# EAGLE design Prototype (EAGLE 7.7.0)
AUTHOR: Nathan Campos; REVISION: A
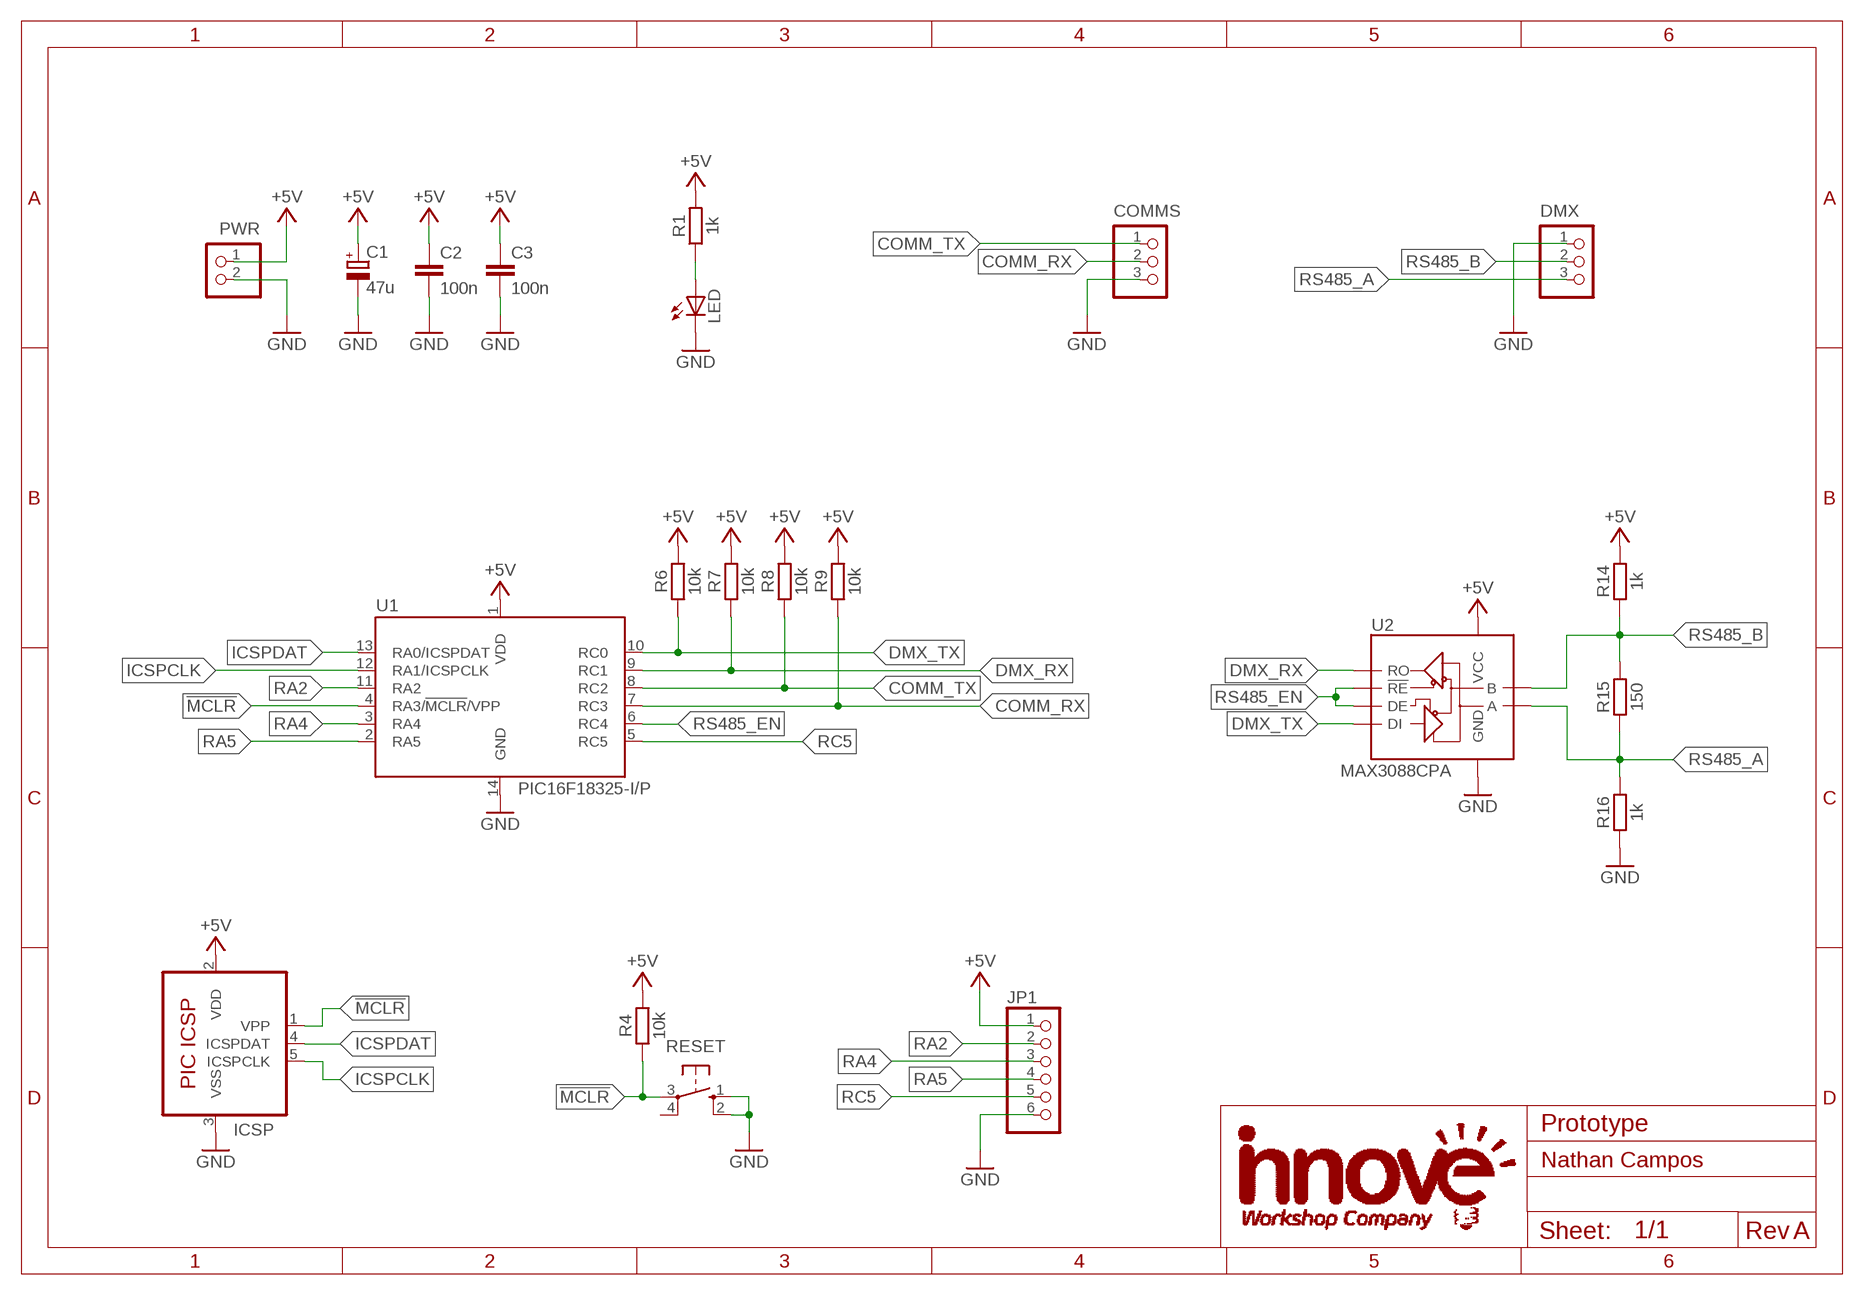
[diagram p0: schematic, sheet 1]

## Parts
C1  47u  CPOL-E2.5-6  [E2,5-6]
C2  100n  C5.0-2.5X7.5  [C050-025X075]
C3  100n  C5.0-2.5X7.5  [C050-025X075]
COMMS  B3B-XH-A  [B3B-XH-A]
DMX  B3B-XH-A  [B3B-XH-A]
ICSP  PIC-ICSP-XH6  [B6B-XH-A]
JP1  PINHD-1X6  [1X06]
LED  LED-JST-XH  [B2B-XH-A]
PWR  B2B-XH-A  [B2B-XH-A]
R1  1k  RT0207  [0207/10]
R4  10k  RT0207  [0207/10]
R6  10k  RT0207  [0207/10]
R7  10k  RT0207  [0207/10]
R8  10k  RT0207  [0207/10]
R9  10k  RT0207  [0207/10]
R14  1k  RT0207  [0207/10]
R15  150  RT0207  [0207/10]
R16  1k  RT0207  [0207/10]
RESET  TACT-4PIN-THT  [B3F-10XX]
U1  PIC16F18325-I/P  [DIL14]
U2  MAX3088CPA  [DIP-8]

## Nets
!MCLR: ICSP.1(VPP) R4.1 RESET.3(P) U1.4(RA3/!MCLR!/VPP)
+5V: C1.+ C2.1 C3.1 ICSP.2(VDD) JP1.1 PWR.1 R1.2 R4.2 R6.2 R7.2 R8.2 R9.2 R14.2 U1.1(VDD) U2.8(VCC)
COMM_RX: COMMS.2 R9.1 U1.7(RC3)
COMM_TX: COMMS.1 R8.1 U1.8(RC2)
DMX_RX: R7.1 U1.9(RC1) U2.1(RO)
DMX_TX: R6.1 U1.10(RC0) U2.4(DI)
GND: C1.- C2.2 C3.2 COMMS.3 DMX.1 ICSP.3(VSS) JP1.6 LED.2(C) PWR.2 R16.1 RESET.1(S) RESET.2(S1) U1.14(GND) U2.5(GND)
ICSPCLK: ICSP.5(ICSPCLK) U1.12(RA1/ICSPCLK)
ICSPDAT: ICSP.4(ICSPDAT) U1.13(RA0/ICSPDAT)
N$1: LED.1(A) R1.1
RA2: JP1.2 U1.11(RA2)
RA4: JP1.3 U1.3(RA4)
RA5: JP1.4 U1.2(RA5)
RC5: JP1.5 U1.5(RC5)
RS485_A: DMX.3 R15.1 R16.2 U2.6(A)
RS485_B: DMX.2 R14.1 R15.2 U2.7(B)
RS485_EN: U1.6(RC4) U2.2(!RE) U2.3(DE)
Unconnected: RESET.4(P1)

## Library data of the parts
C1 = innove-passives:CPOL: Polarized Capacitor May come in the electrolytic and tantalum variants
C2 C3 = innove-passives:C: Ceramic Capacitor Those little yellow/brown things
COMMS DMX = innove-con-jst-xh:B3B-XH-A: Wire-to-Board 2.5mm pitch top mount connector Source: http://www.jst-mfg.com/product/pdf/jpn/XH.pdf http://www.jst-mfg.com/product/detail.php?series=277
ICSP = innove-con-standard:PIC-ICSP
JP1 = pinhead:PINHD-1X6: PIN HEADER
LED = innove-leds:LED: LED OSRAM: - CHIPLED LG R971, LG N971, LY N971, LG Q971, LY Q971, LO R971, LY R971 LH N974, LH R974 LS Q976, LO Q976, LY Q976 LO Q996 - Hyper CHIPLED LW Q18S LB Q993, LB Q99A, LB R99A - SideLED LS A670, LO A670, LY A670, LG A670, LP A670 LB A673, LV A673, LT A673, LW A673 LH A674 LY A675 LS A676, LA A676, LO A676, LY A676, LW A676 LS A679, LY A679, LG A679 - Hyper Micro SIDELED® LS Y876, LA Y876, LO Y876, LY Y876 LT Y87S - SmartLED LW L88C, LW L88S LB L89C, LB L89S, LG L890 LS L89K, LO L89K, LY L89K LS L896, LA L896, LO L896, LY L896 - TOPLED LS T670, LO T670, LY T670, LG T670, LP T670 LSG T670, LSP T670, LSY T670, LOP T670, LYG T670 LG T671, LOG T671, LSG T671 LB T673, LV T673, LT T673, LW T673 LH T674 LS T676, LA T676, LO T676, LY T676, LB T676, LH T676, LSB T676, LW T676 LB T67C, LV T67C, LT T67C, LS T67K, LO T67K, LY T67K, LW E67C LS E67B, LA E67B, LO E67B, LY E67B, LB E67C, LV E67C, LT E67C LW T67C LS T679, LY T679, LG T679 LS T770, LO T770, LY T770, LG T770, LP T770 LB T773, LV T773, LT T773, LW T773 LH T774 LS E675, LA E675, LY E675, LS T675 LS T776, LA T776, LO T776, LY T776, LB T776 LHGB T686 LT T68C, LB T68C - Hyper Mini TOPLED® LB M676 - Mini TOPLED Santana® LG M470 LS M47K, LO M47K, LY M47K Source: http://www.osram.convergy.de LUXEON: - LUMILED® LXK2-PW12-R00, LXK2-PW12-S00, LXK2-PW14-U00, LXK2-PW14-V00 LXK2-PM12-R00, LXK2-PM12-S00, LXK2-PM14-U00 LXK2-PE12-Q00, LXK2-PE12-R00, LXK2-PE12-S00, LXK2-PE14-T00, LXK2-PE14-U00 LXK2-PB12-K00, LXK2-PB12-L00, LXK2-PB12-M00, LXK2-PB14-N00, LXK2-PB14-P00, LXK2-PB14-Q00 LXK2-PR12-L00, LXK2-PR12-M00, LXK2-PR14-Q00, LXK2-PR14-R00 LXK2-PD12-Q00, LXK2-PD12-R00, LXK2-PD12-S00 LXK2-PH12-R00, LXK2-PH12-S00 LXK2-PL12-P00, LXK2-PL12-Q00, LXK2-PL12-R00 Source: www.luxeon.com KINGBRIGHT: KA-3528ASYC Source: www.kingbright.com
PWR = innove-con-jst-xh:B2B-XH-A: Wire-to-Board 2.5mm pitch top mount connector Source: http://www.jst-mfg.com/product/pdf/jpn/XH.pdf http://www.jst-mfg.com/product/detail.php?series=277
R1 R4 R6-R9 R14-R16 = innove-passives:R: Resistor This is officially the most boring component ever.
RESET = innove-switches:TACT-4PIN: 4 Pin Tactile Switch The most ubiquitous kind of tactile switch.; MPN: B3F-1000; OC_FARNELL: 176432; OC_NEWARK: 36M3542
U1 = innove-microcontrollers:PIC16F18325: Microchip PIC16F18325 PIC16F18325 microcontrollers feature Analog, Core Independent Peripherals and communication peripherals, combined with Extreme Low Power (XLP) for wide range of general purpose and low power applications. The Peripheral Pin Select (PPS) functionality enables pin mapping when using the digital peripherals (CLC, CWG, CCP, PWM and communications) to add flexibility to the application design. Additional Features: Enhanced Mid-range Core with 49 Instruction, 16 Stack Levels Flash Program Memory with self read/write capability 256B EEPROM IDLE and DOZE low power modes Peripheral Module Disable (PMD) Peripheral Pin Select (PPS) 2x 10-bit PWMs 4x Capture, Compare, PWM (CCP) 2x Complementary Waveform Generator (CWG) Module Numerically Controlled Oscillator (NCO) 4x Configurable Logic Controller (CLC) 15 Channel 10-bit ADC with Voltage Reference 5-bit Digital to Analog Converter (DAC) 2x Comparator 2x SPI/I2C Enhanced Universal Synchronous Asynchronous Receiver Transmitter (EUSART) 4x 8-bit Timers (TMR0/TMR2) 3x 16-bit Timer (TMR1) Extended Watchdog Timer (WDT) Enhanced Power-On/Off-Reset Low-Power Brown-Out Reset (LPBOR) Programmable Brown-Out Reset (BOR) In Circuit Serial Programming (ICSP) PIC16LF18325 (1.8V – 3.6V) PIC16F18325 (2.3V – 5.5V) Source: https://www.microchip.com/wwwproducts/en/PIC16F18325
U2 = innove-ic-comms:MAX3088

## Board
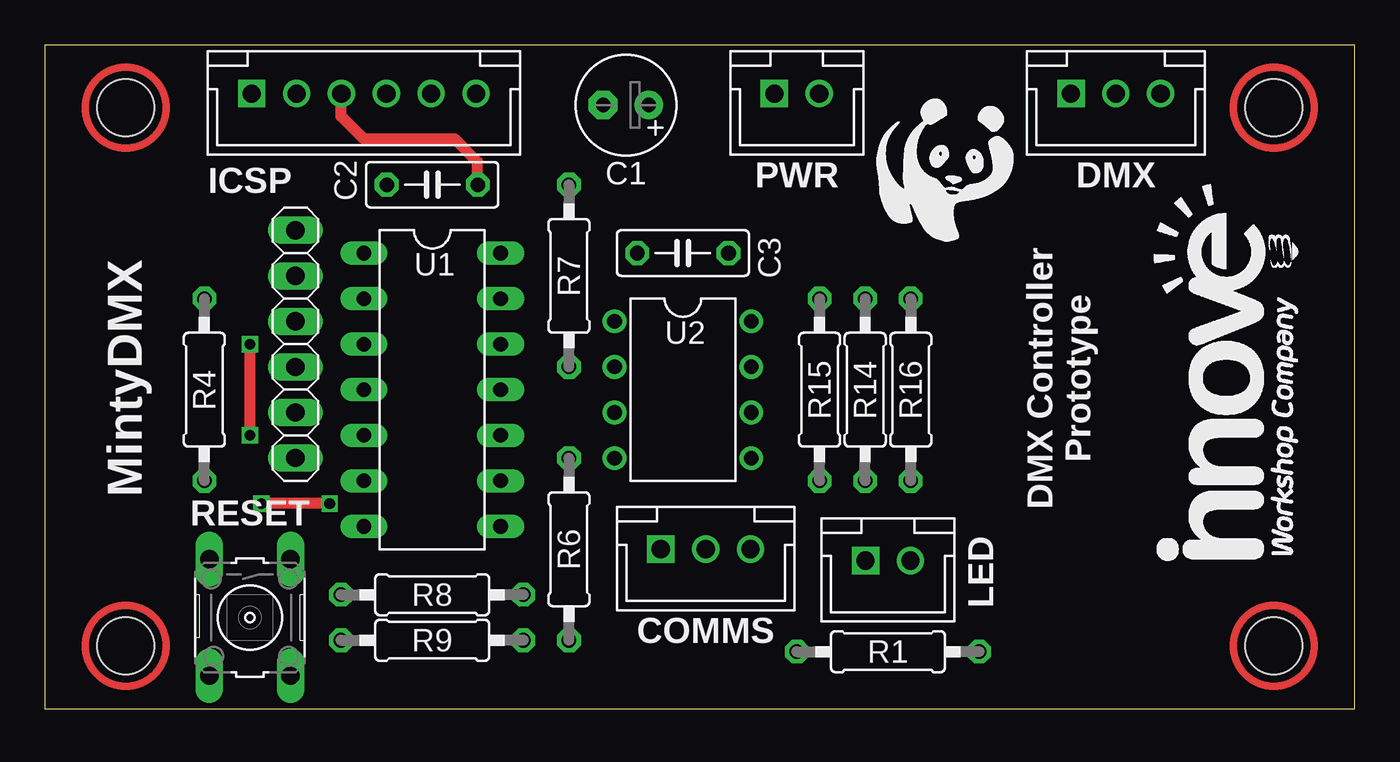
[diagram p1: board, top side]
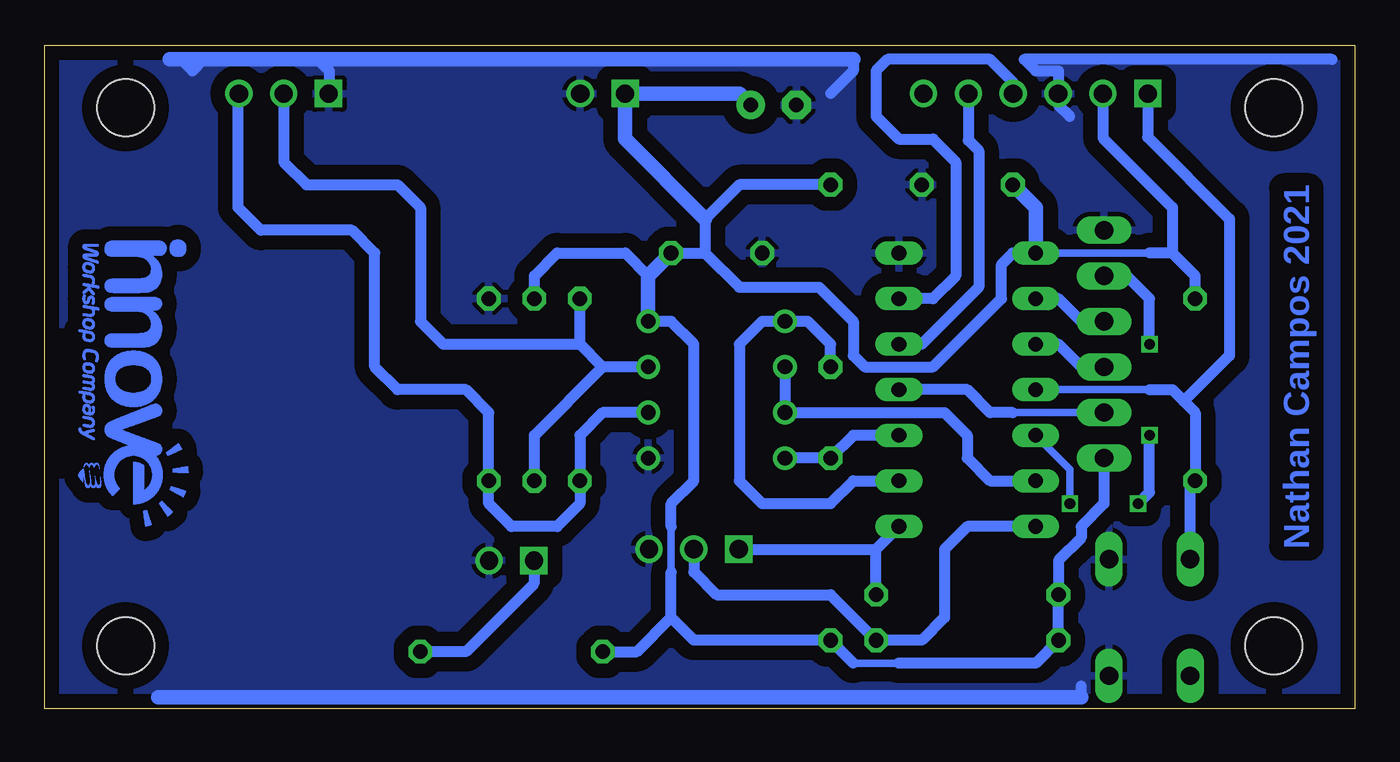
[diagram p2: board, bottom side, seen from below]

Size 73 x 37 mm. Coordinates in mm from the lower left corner, seen from the top.
Outline: 0,0 73,0 73,37 0,37 0,0
Copper layers (1*16): Top 0.035mm / dielectric 1.5mm / Bottom 0.035mm
Design rules "seeedstudio-2layers": minimum track width 6mil, minimum drill 12mil, track to track 6mil, track to pad 6mil, pad to pad 6mil, via to via 6mil, smd to smd 0mil, copper to edge 10mil, drill to drill 10mil, minimum pad ring 10mil, minimum via ring 6mil, stop-mask expansion 2mil, vias tented up to drill 100mil, thermal gap 10mil
Holes 3.2 mm at 4.5,3.5 4.5,33.5 68.5,3.5 68.5,33.5
tKeepout: area 43,12 to 52,24
tRestrict: area 52,9 to 73,28

### Footprints (pad centres in the part's own frame; a part is rotated, then mirrored left to right if it is on the bottom)
E2,5-6 = drill 0.813 pad 1.6: + -1.27,0 | drill 0.813 pad 1.6 octagon: - 1.27,0
C050-025X075 = drill 0.813 octagon: 1 -2.54,0; 2 2.54,0
B3B-XH-A = drill 1.016 square: 1 -2.5,0 | drill 1.016: 2 0,0; 3 2.5,0
B6B-XH-A = drill 1.016 square: 1 -6.25,0 | drill 1.016: 2 -3.75,0; 3 -1.25,0; 4 1.25,0; 5 3.75,0; 6 6.25,0
1X06 = drill 1.016 long: 1 -6.35,0; 2 -3.81,0; 3 -1.27,0; 4 1.27,0; 5 3.81,0; 6 6.35,0
B2B-XH-A = drill 1.016 square: 1 -1.25,0 | drill 1.016: 2 1.25,0
0207/10 = drill 0.813 octagon: 1 -5.08,0; 2 5.08,0
B3F-10XX = drill 1.016 long: 1 -3.251,2.261; 2 3.251,2.261; 3 -3.251,-2.261; 4 3.251,-2.261
DIL14 = drill 0.813 long: 1 -7.62,-3.81; 2 -5.08,-3.81; 3 -2.54,-3.81; 4 0,-3.81; 5 2.54,-3.81; 6 5.08,-3.81; 7 7.62,-3.81; 8 7.62,3.81; 9 5.08,3.81; 10 2.54,3.81; 11 0,3.81; 12 -2.54,3.81; 13 -5.08,3.81; 14 -7.62,3.81
DIP-8 = drill 0.813 pad 1.27: 1 -3.81,-3.81; 2 -1.27,-3.81; 3 1.27,-3.81; 4 3.81,-3.81; 5 3.81,3.81; 6 1.27,3.81; 7 -1.27,3.81; 8 -3.81,3.81

### Placement (x,y rotation side)
C1  32.38,33.66 180 top
C2  21.59,29.21 0 top
C3  35.56,25.4 180 top
COMMS  36.83,8.89 0 top
DMX  59.69,34.29 0 top
ICSP  17.78,34.29 0 top
JP1  13.97,20.32 90 top
LED  46.99,8.26 0 top
PWR  41.91,34.29 0 top
R1  46.99,3.17 180 top
R4  8.89,17.78 90 top
R6  29.21,8.89 270 top
R7  29.21,24.13 90 top
R8  21.59,6.35 180 top
R9  21.59,3.81 180 top
R14  45.72,17.78 90 top
R15  43.18,17.78 90 top
R16  48.26,17.78 270 top
RESET  11.43,5.08 270 top
U1  21.59,17.78 270 top
U2  35.56,17.78 270 top

### Tracks (layer width: path | path; a pad name or v marks a point on that pad's centre or on a via)
!MCLR
  Bottom 0.406: U1.4 11.43,17.78
  Bottom 0.61: 11.43,17.78 10.16,17.78 9.53,17.14 | 9.53,17.14 8.89,16.51 R4.1 9.17,12.42 RESET.3 | ICSP.1 11.53,31.85 6.99,27.3 6.99,19.68 9.53,17.14
+5V
  Bottom 0.406: 38.1,7.62 38.1,10.16 | 25.4,2.54 27.94,2.54 | 11.43,25.4 U1.1
  Bottom 0.61: R14.2 45.72,24.13 44.45,25.4 40.64,25.4 39.37,24.13 | C3.1 36.2,25.4 | 36.2,25.4 34.29,23.5 29.84,23.5 27.94,21.59 27.94,19.68 27.3,19.05 23.5,19.05 19.68,22.86 19.68,24.77 19.05,25.4 U1.1 | R7.2 34.29,29.21 36.2,27.3 36.2,25.4 | 38.1,5.08 36.83,3.81 R6.2 27.94,2.54 | 38.1,5.08 38.1,7.62 | 38.1,10.16 38.1,11.43 36.83,12.7 36.83,20.32 38.1,21.59 U2.8 | R1.2 40.01,3.17 38.1,5.08 | 25.4,2.54 17.78,2.54 R9.2 R8.2 16.51,8.26 15.24,9.53 15.24,10.16 13.97,11.43 JP1.1 | R4.2 8.89,24.13 10.16,25.4 | 10.16,25.4 11.43,25.4 | ICSP.2 14.03,31.81 10.16,27.94 10.16,25.4
  Bottom 0.813: C3.1 39.37,24.13 U2.8 | C2.1 17.78,27.94 U1.1 | 36.2,27.3 40.66,31.77 PWR.1 34.29,34.29 C1.+
COMM_RX
  Bottom 0.61: COMMS.2 36.83,7.62 35.56,6.35 29.21,6.35 R9.1 24.13,3.81 22.86,5.08 22.86,8.89 21.59,10.16 U1.7
COMM_TX
  Bottom 0.61: R8.1 26.67,8.89 | 26.67,8.89 U1.8 | COMMS.1 26.67,8.89
DMX_RX
  Bottom 0.61: R7.1 29.21,20.32 30.48,21.59 U2.1 33.02,21.59 34.29,20.32 34.29,12.7 33.02,11.43 29.21,11.43 27.94,12.7 U1.9
DMX_TX
  Bottom 0.61: U1.10 27.94,15.24 R6.1 U2.4
GND
  Top 0.61: C2.2 24.13,30.48 22.86,31.75 17.78,31.75 16.51,33.02 16.51,34.27 ICSP.3
  Bottom 0.61: 15.24,0.64 15.24,1.27 | 27.94,36.2 27.94,35.56 29.21,34.29 | 66.04,36.2 65.41,36.2 64.77,35.56 64.14,36.2 57.78,36.2 57.15,35.56 57.15,34.33 DMX.1 | 15.88,33.02 16.53,33.67 ICSP.3 16.51,34.31 16.51,35.56 17.78,35.56 18.41,36.2 1.27,36.2
  Bottom 0.813: 15.24,0.64 66.67,0.64 | 27.94,36.2 64.14,36.2 66.04,36.2
  pour Bottom (isolate 0.813): 0,36.83 73.66,36.83 73.66,0 0,0
ICSPCLK
  Bottom 0.61: ICSP.5 21.53,31.69 20.95,31.11 20.95,23.5 24.13,20.32 U1.12
ICSPDAT
  Bottom 0.61: ICSP.4 19.03,34.91 20.32,36.2 26.04,36.2 26.67,35.56 26.67,33.02 25.4,31.75 23.5,31.75 22.23,30.48 22.23,24.13 23.5,22.86 U1.13
N$1
  Bottom 0.61: LED.1 45.74,6.96 49.53,3.17 R1.1
N$2  (via drill 0.25 pad 1.68)
  other vias: 4.5,33.5
N$3  (via drill 0.25 pad 1.68)
  other vias: 4.5,3.5
N$4  (via drill 0.25 pad 1.68)
  other vias: 68.5,3.5
N$5  (via drill 0.25 pad 1.68)
  other vias: 68.5,33.5
RA2
  Bottom 0.406: JP1.2 19.05,16.51
  Bottom 0.61: 19.05,16.51 20.32,16.51 21.59,17.78 U1.11
RA4
  Bottom 0.61: JP1.3 15.24,19.05 16.51,20.32 U1.3
RA5
  Bottom 0.61: JP1.4 15.24,21.59 16.51,22.86 U1.2
RC5  (via drill 0.6)
  Top 0.61: v15.88,11.43 v12.06,11.43 | v11.43,15.24 v11.43,20.32
  Bottom 0.406: U1.5 15.88,13.34 v15.88,11.43
  Bottom 0.61: v12.06,11.43 11.43,12.06 v11.43,15.24 | v11.43,20.32 11.43,22.86 12.7,24.13 JP1.5
RS485_A
  Bottom 0.61: U2.6 41.91,16.51 43.18,15.24 R15.1 43.18,11.43 44.45,10.16 46.99,10.16 48.26,11.43 R16.2 48.26,16.51 49.53,17.78 53.34,17.78 54.61,19.05 54.61,25.4 55.88,26.67 60.96,26.67 62.23,27.94 62.23,34.25 DMX.3
RS485_B
  Bottom 0.61: U2.7 41.91,19.05 | 41.91,19.05 43.18,20.32 | 43.18,20.32 R15.2 | R14.1 45.72,15.24 41.91,19.05 | DMX.2 59.69,30.48 58.42,29.21 53.34,29.21 52.07,27.94 52.07,21.59 50.8,20.32 43.18,20.32
RS485_EN
  Bottom 0.61: U2.2 U2.3 22.86,16.51 21.59,15.24 21.59,13.97 20.32,12.7 U1.6
(copper drawn outside any net)
  shapes: Bottom area x3507, Top circle x4

### Text on the board
Bottom: Nathan Campos 2021
tPlace: MintyDMX | DMX Controller / Prototype